# EAGLE design list_1 (EAGLE 6.3)
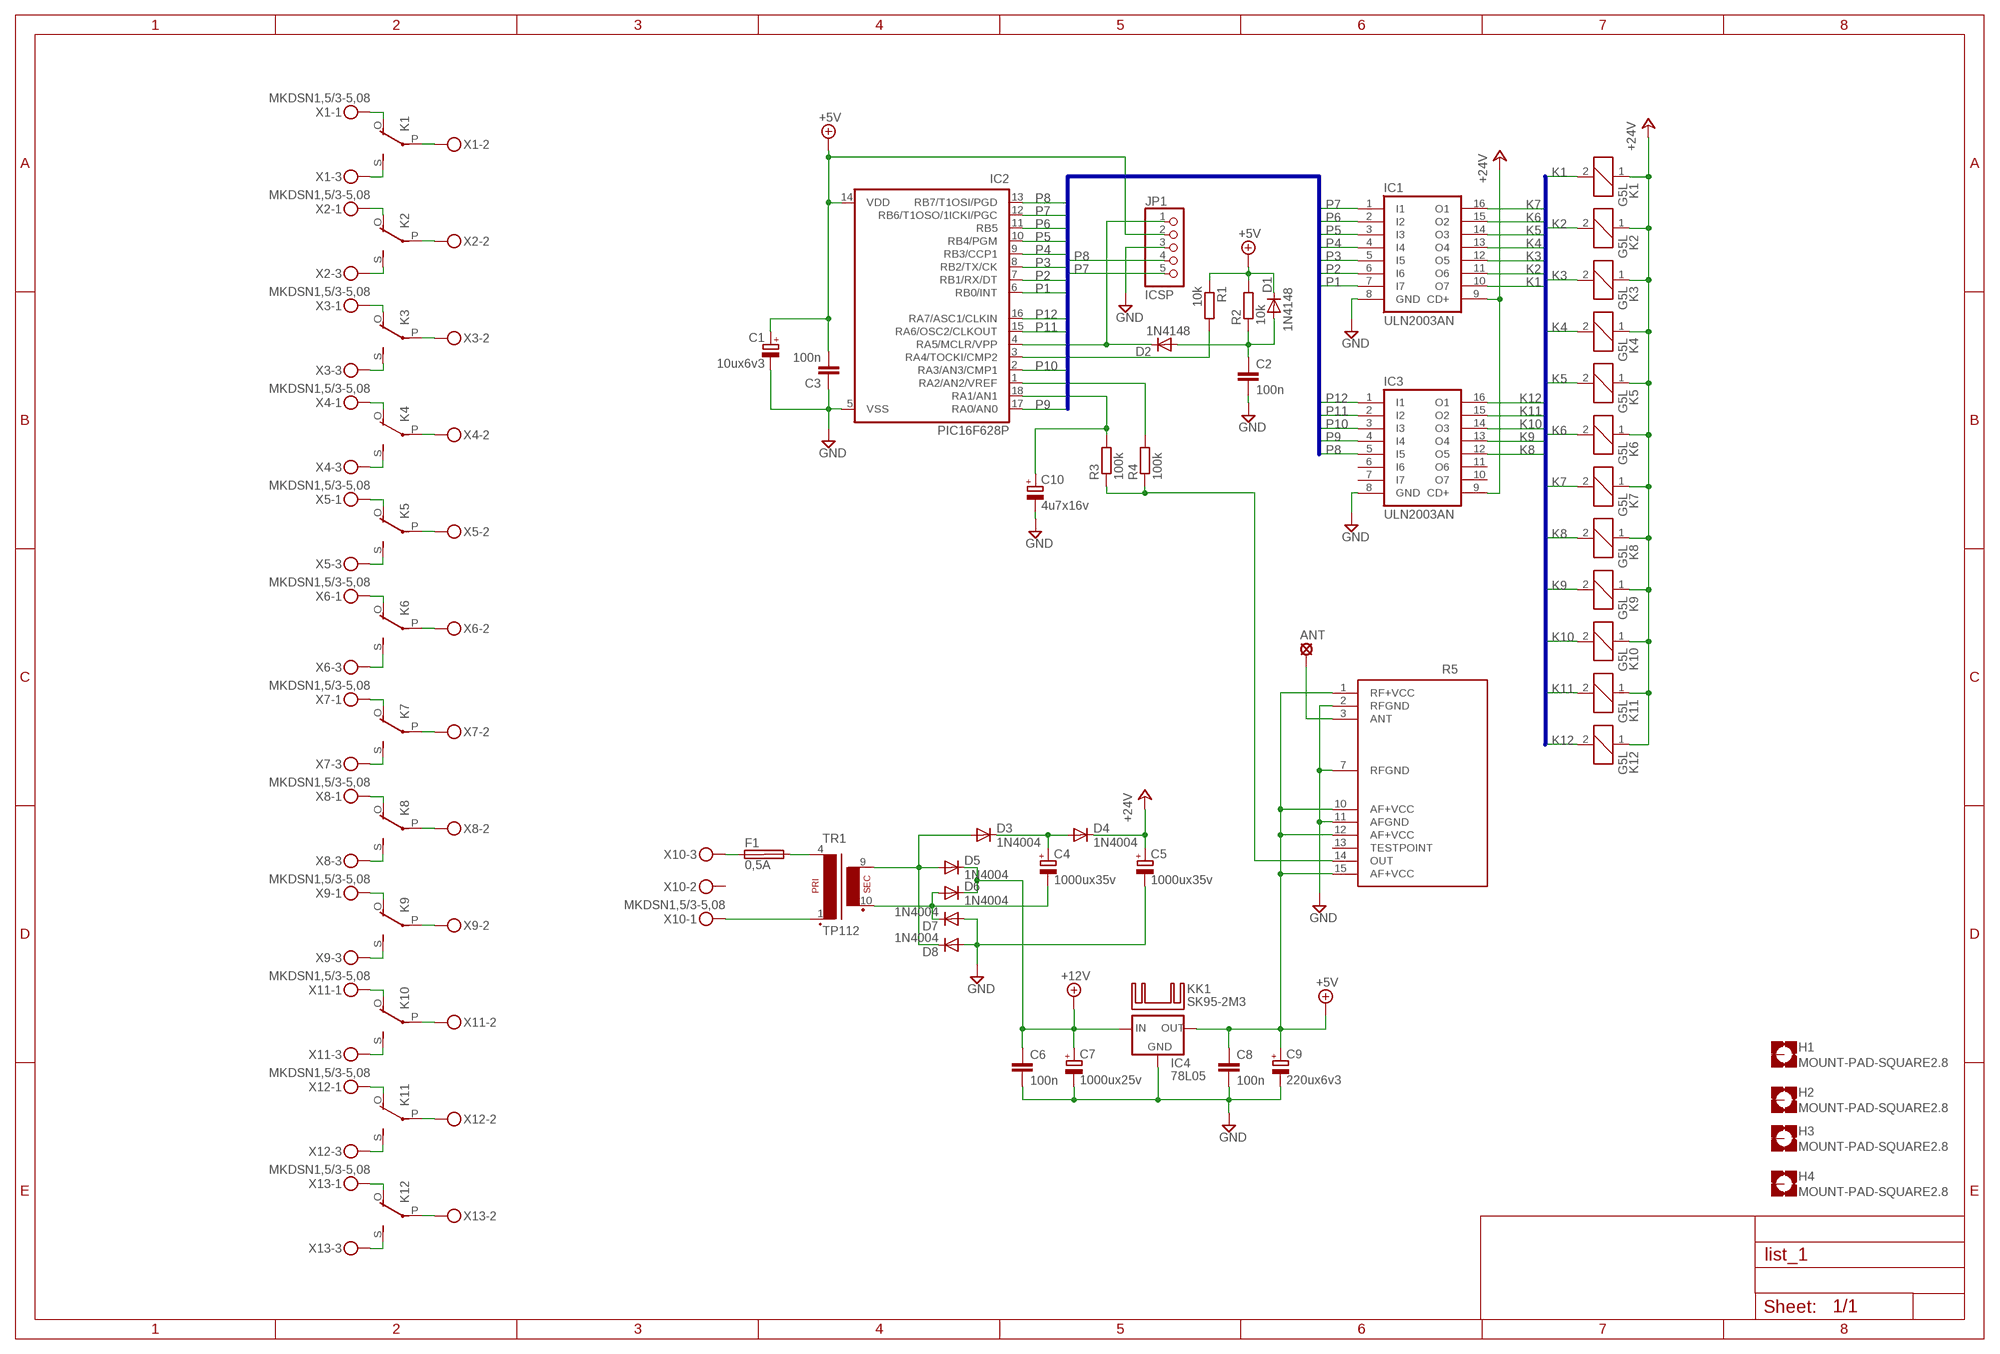
[diagram p0: schematic, sheet 1]

## Parts
ANT  SE14  [SE14]
C1  10ux6v3  CPOL-EUE2.5-5  [E2,5-5]
C2  100n  C-EU050-025X075  [C050-025X075]
C3  100n  C-EU050-025X075  [C050-025X075]
C4  1000ux35v  CPOL-EUE3.5-8  [E3,5-8]
C5  1000ux35v  CPOL-EUE3.5-10  [E3,5-10]
C6  100n  C-EU050-025X075  [C050-025X075]
C7  1000ux25v  CPOL-EUE3.5-8  [E3,5-8]
C8  100n  C-EU050-025X075  [C050-025X075]
C9  220ux6v3  CPOL-EUE2.5-5  [E2,5-5]
C10  4u7x16v  CPOL-EUE2.5-5  [E2,5-5]
D1  1N4148  1N4148DO35-10  [DO35-10]
D2  1N4148  1N4148DO35-10  [DO35-10]
D3  1N4004  [DO41-10]
D4  1N4004  [DO41-10]
D5  1N4004  [DO41-10]
D6  1N4004  [DO41-10]
D7  1N4004  [DO41-10]
D8  1N4004  [DO41-10]
F1  0,5A  SHK20L  [SHK20L]
H1  MOUNT-PAD-SQUARE2.8  [2,8-PAD-SQUARE]
H2  MOUNT-PAD-SQUARE2.8  [2,8-PAD-SQUARE]
H3  MOUNT-PAD-SQUARE2.8  [2,8-PAD-SQUARE]
H4  MOUNT-PAD-SQUARE2.8  [2,8-PAD-SQUARE]
IC1  ULN2003AN  [DIL16]
IC2  PIC16F628P  [DIL18]
IC3  ULN2003AN  [DIL16]
IC4  78L05  78XXS  [78XXS]
JP1  ICSP  PINHD-1X5  [1X05]
K1  G5L  [G5LE]
K2  G5L  [G5LE]
K3  G5L  [G5LE]
K4  G5L  [G5LE]
K5  G5L  [G5LE]
K6  G5L  [G5LE]
K7  G5L  [G5LE]
K8  G5L  [G5LE]
K9  G5L  [G5LE]
K10  G5L  [G5LE]
K11  G5L  [G5LE]
K12  G5L  [G5LE]
KK1  SK95-2M3  [SK95-2M3]
R1  10k  R-EU_0207/10  [0207/10]
R2  10k  R-EU_0207/10  [0207/10]
R3  100k  R-EU_0207/10  [0207/10]
R4  100k  R-EU_0207/10  [0207/10]
R5  RR10  [RR10V]
TR1  TP112  [TR112]
X1  MKDSN1,5/3-5,08  [MKDSN1,5/3-5,08]
X2  MKDSN1,5/3-5,08  [MKDSN1,5/3-5,08]
X3  MKDSN1,5/3-5,08  [MKDSN1,5/3-5,08]
X4  MKDSN1,5/3-5,08  [MKDSN1,5/3-5,08]
X5  MKDSN1,5/3-5,08  [MKDSN1,5/3-5,08]
X6  MKDSN1,5/3-5,08  [MKDSN1,5/3-5,08]
X7  MKDSN1,5/3-5,08  [MKDSN1,5/3-5,08]
X8  MKDSN1,5/3-5,08  [MKDSN1,5/3-5,08]
X9  MKDSN1,5/3-5,08  [MKDSN1,5/3-5,08]
X10  MKDSN1,5/3-5,08  [MKDSN1,5/3-5,08]
X11  MKDSN1,5/3-5,08  [MKDSN1,5/3-5,08]
X12  MKDSN1,5/3-5,08  [MKDSN1,5/3-5,08]
X13  MKDSN1,5/3-5,08  [MKDSN1,5/3-5,08]

## Nets
+5V: C1.+ C3.2 C8.1 C9.+ D1.C IC2.14(VDD) IC4.OUT JP1.2 R1.1 R2.2 R5.1(RF+VCC) R5.10(AF+VCC) R5.12(AF+VCC) R5.15(AF+VCC)
+12V: C6.1 C7.+ D5.C D6.C IC4.IN
+24V: C5.+ D4.C IC1.9(CD+) IC3.9(CD+) K1.1 K2.1 K3.1 K4.1 K5.1 K6.1 K7.1 K8.1 K9.1 K10.1 K11.1 K12.1
GND: C1.- C2.2 C3.1 C5.- C6.2 C7.- C8.2 C9.- C10.- D7.A D8.A IC1.8(GND) IC2.5(VSS) IC3.8(GND) IC4.GND JP1.3 R5.2(RFGND) R5.7(RFGND) R5.11(AFGND)
K1: IC1.10(O7) K1.2
K2: IC1.11(O6) K2.2
K3: IC1.12(O5) K3.2
K4: IC1.13(O4) K4.2
K5: IC1.14(O3) K5.2
K6: IC1.15(O2) K6.2
K7: IC1.16(O1) K7.2
K8: IC3.12(O5) K8.2
K9: IC3.13(O4) K9.2
K10: IC3.14(O3) K10.2
K11: IC3.15(O2) K11.2
K12: IC3.16(O1) K12.2
N$1: K2.S(2:S) X2.3
N$2: K1.P(2:P) X1.2
N$3: K1.S(2:S) X1.3
N$4: K1.O(2:O) X1.1
N$5: K2.O(2:O) X2.1
N$6: K2.P(2:P) X2.2
N$7: K3.P(2:P) X3.2
N$8: K3.S(2:S) X3.3
N$9: K3.O(2:O) X3.1
N$10: K4.O(2:O) X4.1
N$11: K4.P(2:P) X4.2
N$12: K4.S(2:S) X4.3
N$13: K5.P(2:P) X5.2
N$14: K5.O(2:O) X5.1
N$15: K5.S(2:S) X5.3
N$16: K6.P(2:P) X6.2
N$17: K6.O(2:O) X6.1
N$18: K6.S(2:S) X6.3
N$19: K7.P(2:P) X7.2
N$20: K7.O(2:O) X7.1
N$21: K7.S(2:S) X7.3
N$22: K8.P(2:P) X8.2
N$23: K9.P(2:P) X9.2
N$24: K10.P(2:P) X11.2
N$25: K11.P(2:P) X12.2
N$26: K12.P(2:P) X13.2
N$27: K8.O(2:O) X8.1
N$28: K8.S(2:S) X8.3
N$29: K9.O(2:O) X9.1
N$30: K9.S(2:S) X9.3
N$31: K10.O(2:O) X11.1
N$32: K10.S(2:S) X11.3
N$33: K11.O(2:O) X12.1
N$34: K11.S(2:S) X12.3
N$35: K12.O(2:O) X13.1
N$36: K12.S(2:S) X13.3
N$37: C10.+ IC2.18(RA1/AN1) R3.2
N$38: IC2.1(RA2/AN2/VREF) R4.2
N$39: R3.1 R4.1 R5.14(OUT)
N$40: D2.C IC2.4(RA5/MCLR/VPP) JP1.1
N$41: IC2.3(RA4/TOCKI/CMP2) R1.2
N$42: C2.1 D1.A D2.A R2.1
N$43: ANT.MP R5.3(ANT)
N$45: F1.2A TR1.4(P1)
N$47: TR1.1(P2) X10.1
N$48: F1.1A X10.3
N$49: C4.- D6.A D7.C TR1.10(S3)
N$50: D3.A D5.A D8.C TR1.9(S4)
N$53: C4.+ D3.C D4.A
P1: IC1.7(I7) IC2.6(RB0/INT)
P2: IC1.6(I6) IC2.7(RB1/RX/DT)
P3: IC1.5(I5) IC2.8(RB2/TX/CK)
P4: IC1.4(I4) IC2.9(RB3/CCP1)
P5: IC1.3(I3) IC2.10(RB4/PGM)
P6: IC1.2(I2) IC2.11(RB5)
P7: IC1.1(I1) IC2.12(RB6/T1OSO/1ICKI/PGC) JP1.5
P8: IC2.13(RB7/T1OSI/PGD) IC3.5(I5) JP1.4
P9: IC2.17(RA0/AN0) IC3.4(I4)
P10: IC2.2(RA3/AN3/CMP1) IC3.3(I3)
P11: IC2.15(RA6/OSC2/CLKOUT) IC3.2(I2)
P12: IC2.16(RA7/ASC1/CLKIN) IC3.1(I1)
Unconnected: F1.1B F1.2B H1.B2,8(MOUNT) H2.B2,8(MOUNT) H3.B2,8(MOUNT) H4.B2,8(MOUNT) IC3.6(I6) IC3.7(I7) IC3.10(O7) IC3.11(O6) R5.13(TESTPOINT) X10.2

## Buses
K[1..12]
P[1..12]

## Library data of the parts
ANT = solpad:SE14: SOLDER PAD E1553, drill 1,4mm, distributor Buerklin, 07F820
C1 C4 C5 C7 C9 C10 = rcl:CPOL-EU: POLARIZED CAPACITOR, European symbol
C2 C3 C6 C8 = rcl:C-EU: CAPACITOR, European symbol
D1 D2 = diode:1N4148: DIODE high speed (Philips)
D3-D8 = diode:1N4004: DIODE general purpose rectifier, 1 A
F1 = fuse:SHK20L: FUSE HOLDER 5 x 20 mm, SH contact, SHH1 Schukat, E1073 Buerklin
H1-H4 = holes:MOUNT-PAD-SQUARE: MOUNTING PAD, square
IC1 IC3 = uln-udn:ULN2003A: DRIVER ARRAY
IC2 = microchip:PIC16*F62: FLASH-Based 8-Bit CMOS Microcontroller Source: http://ww1.microchip.com/downloads/en/DeviceDoc/40300C.pdf
IC4 = v-reg:78XXS: VOLTAGE REGULATOR
JP1 = pinhead:PINHD-1X5: PIN HEADER
K1-K12 = relay:G5L: RELAY 1 x switch, 10 A/120 V AC, 8 A/30 V ADC, Omron
KK1 = heatsink:SK95-2M3: HEATSINK manufacturer Fischer/distributor Buerklin
R1-R4 = rcl:R-EU_: RESISTOR, European symbol
R5 = rf_moduls:RR10: Moduls telecontrolli Narrow Bandwidth Super Regenerati Receiver - RR10-XXX
TR1 = trafo:TP112
X1-X13 = con-phoenix-508:MKDSN1,5/3-5,08: MKDSN 1,5/ 3-5,08 Printklemme Nennstrom: 13,5 A Nennspannung: 250 V Rastermaß: 5,08 mm Polzahl: 3 Anschlussart: Schraubanschluss Montage: Löten Anschlussrichtung Leiter/Platine: 0 ° Artikelnummer: 1729131 Source: http://eshop.phoenixcontact.com .. 1729131.pdf

## Board
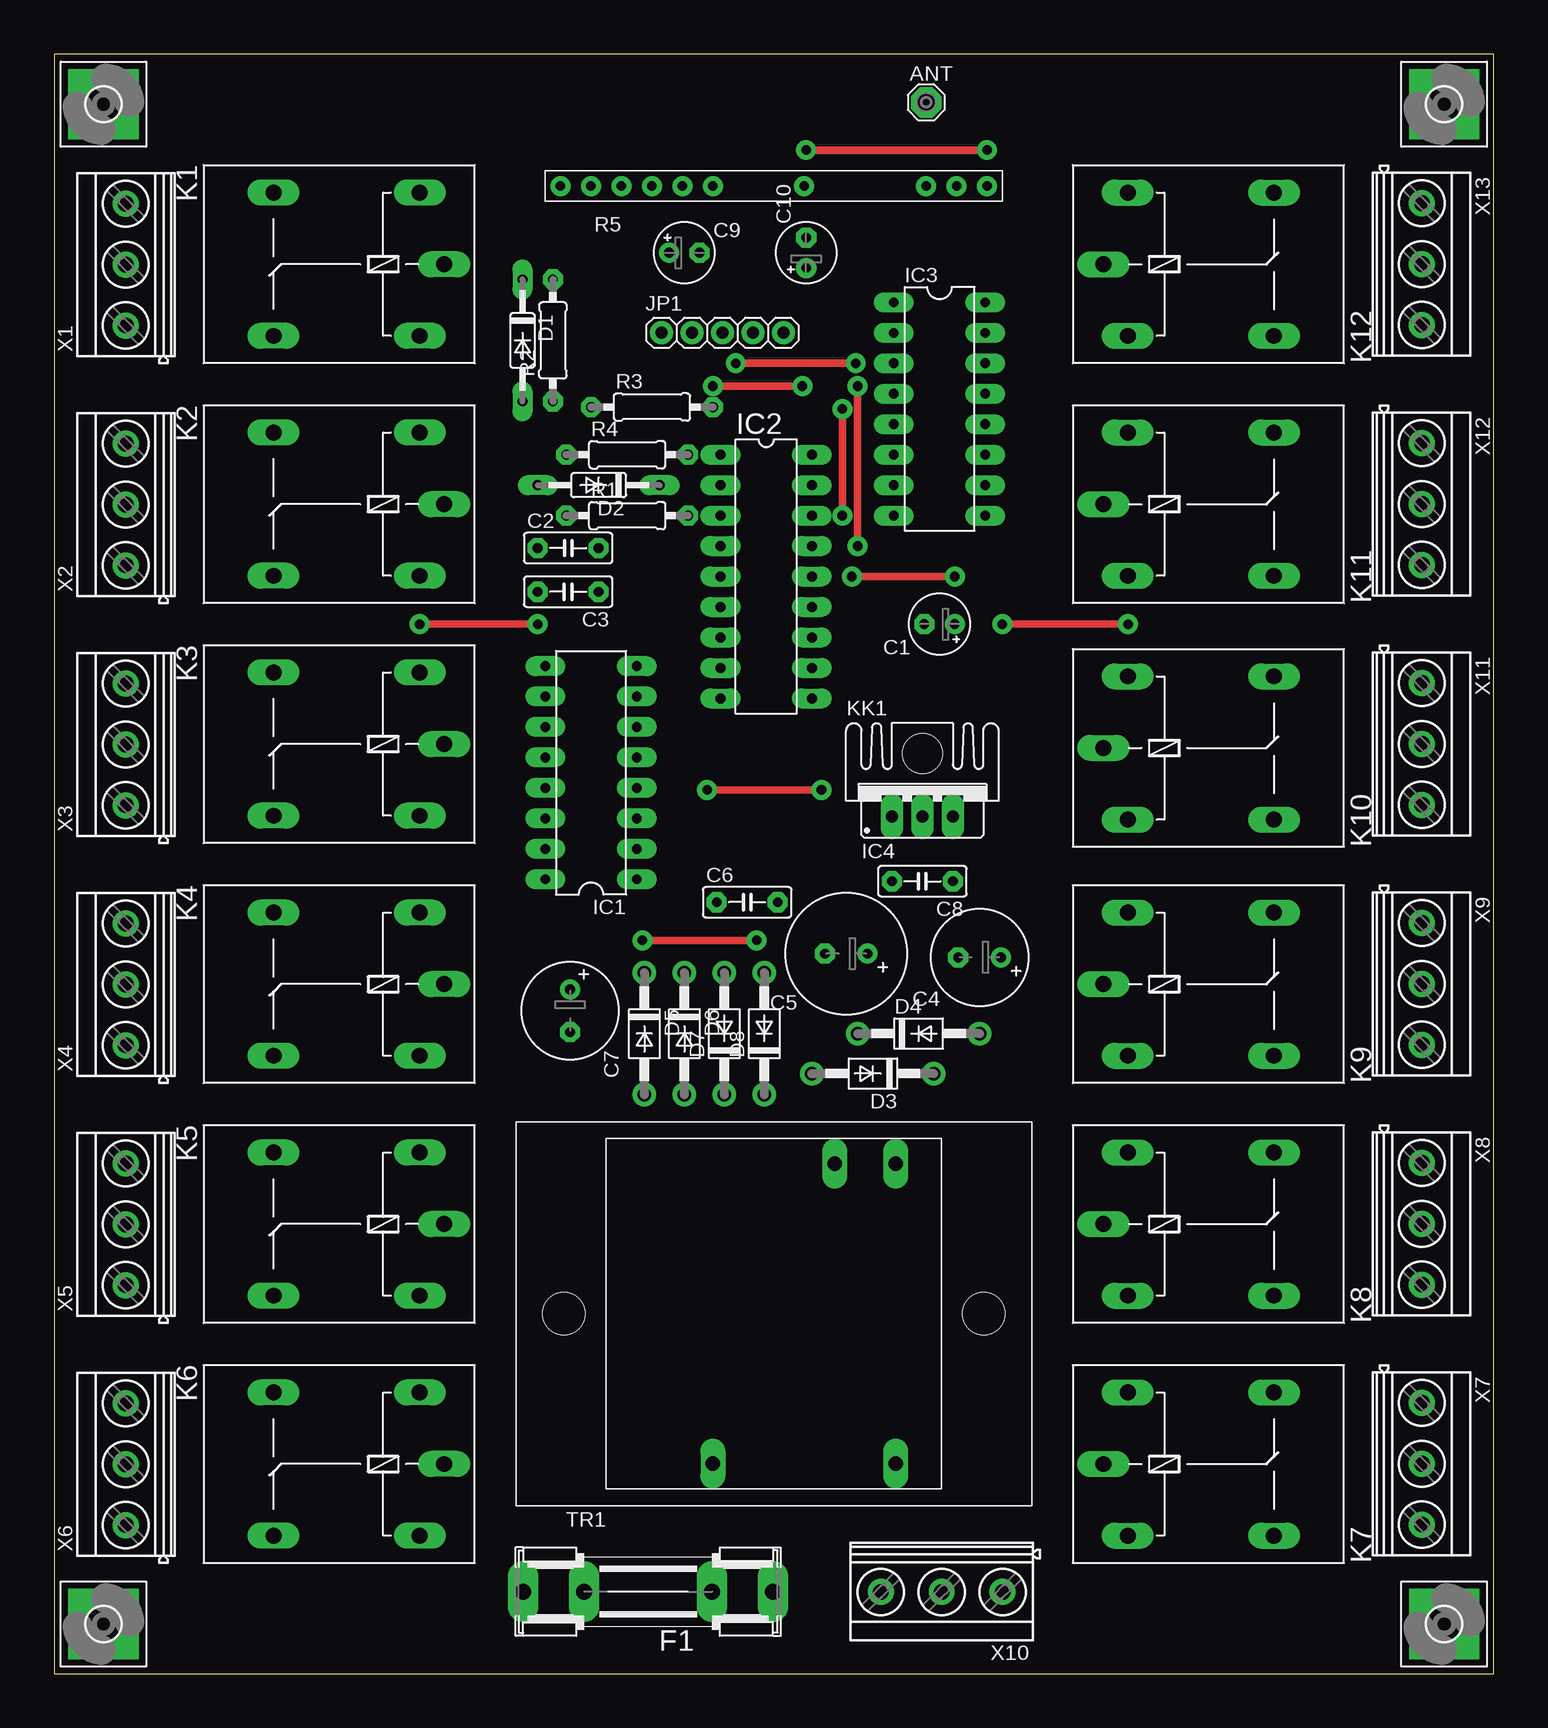
[diagram p1: board, top side]
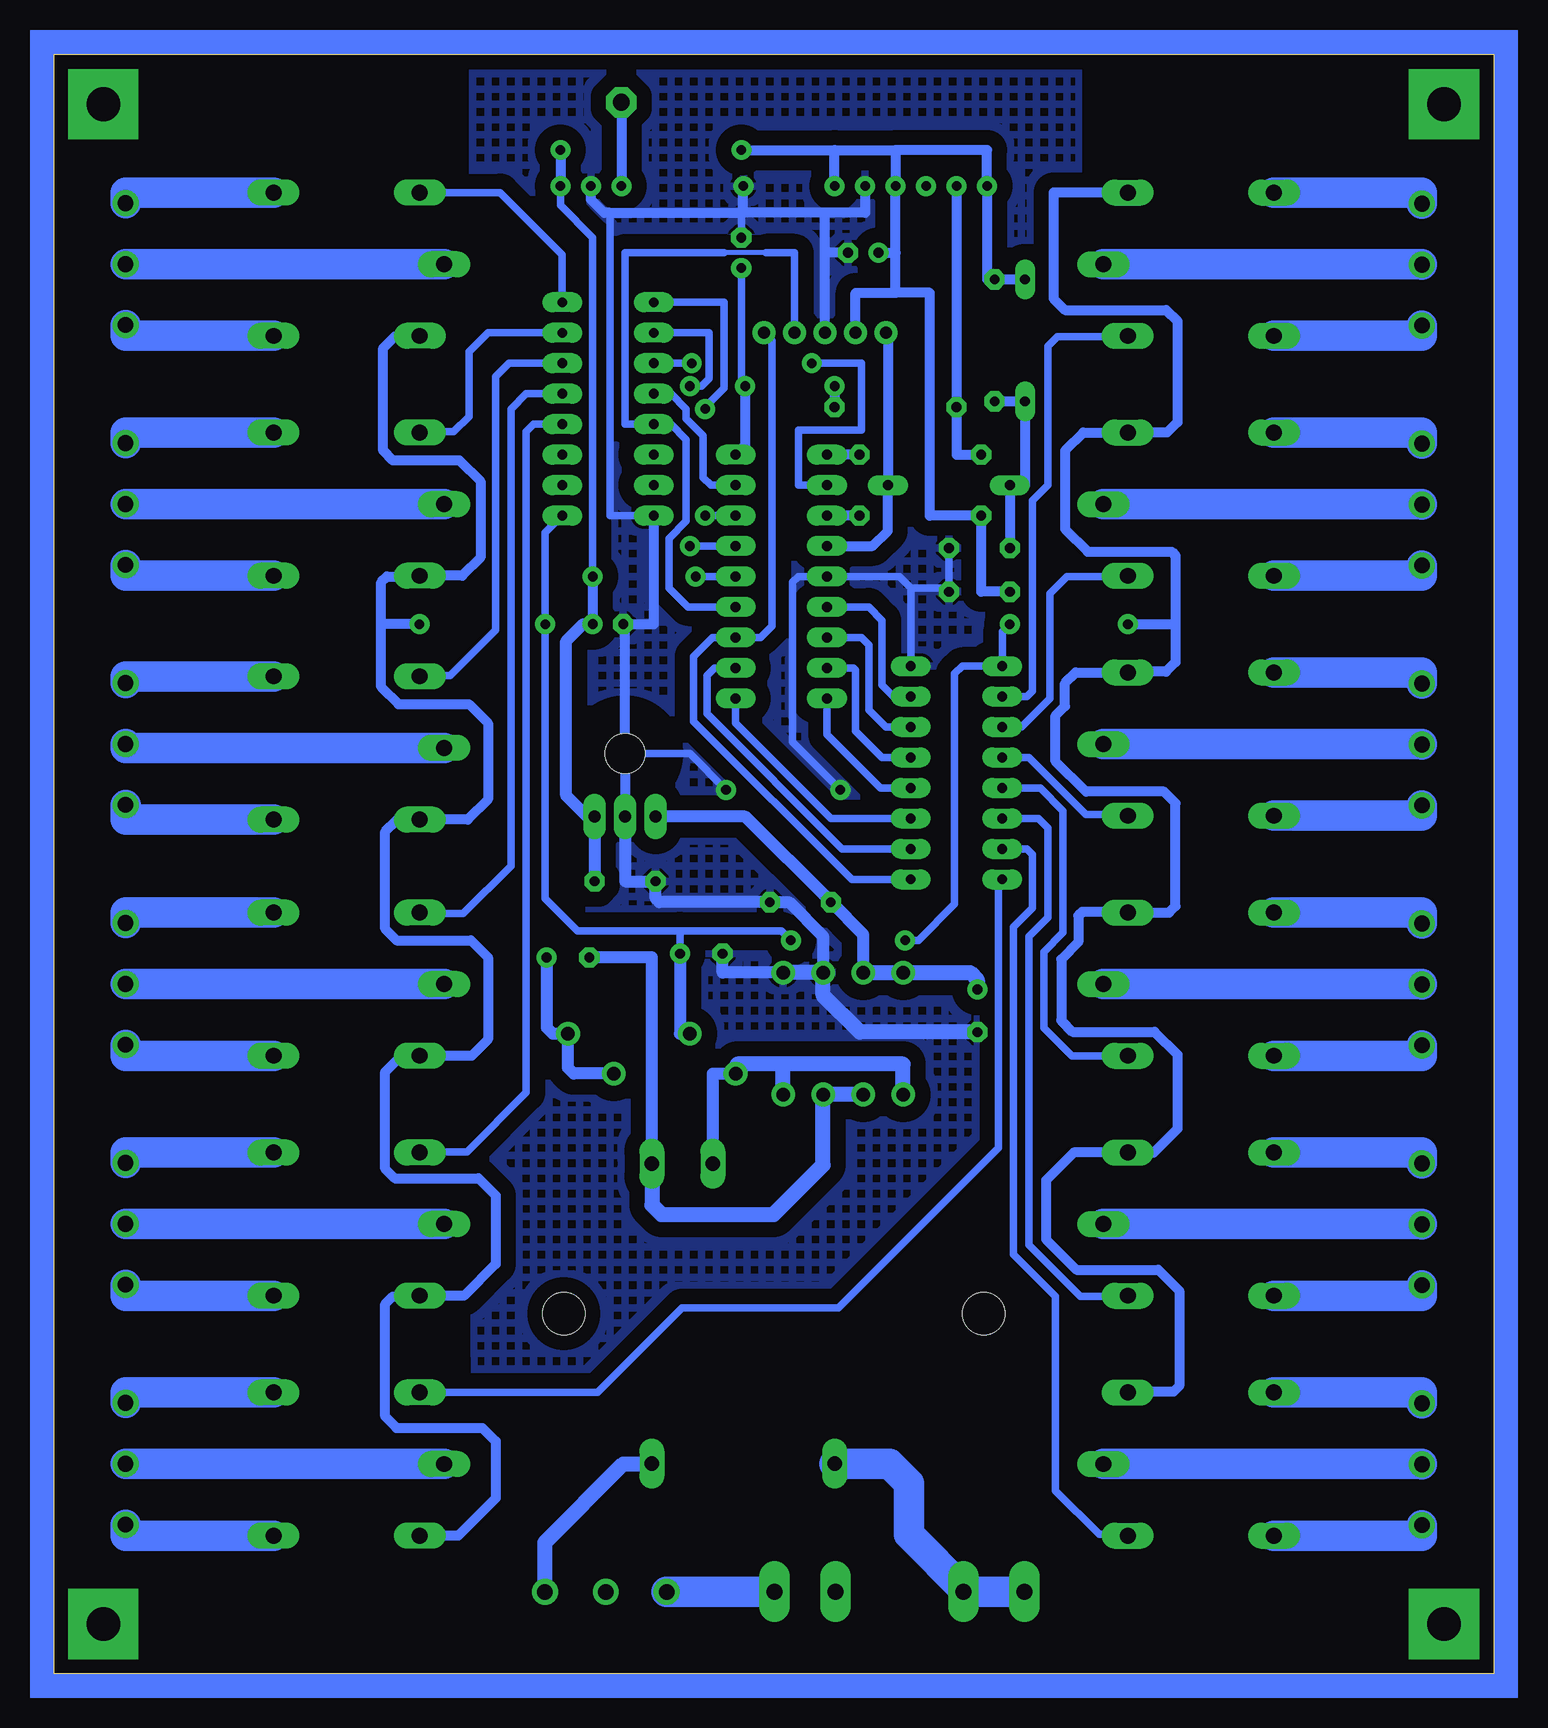
[diagram p2: board, bottom side, seen from below]

Size 120 x 135 mm. Coordinates in mm from the lower left corner, seen from the top.
Outline: 0,0 120,0 120,135 0,135 0,0
Copper layers (1*16): Top 0.035mm / dielectric 1.5mm / Bottom 0.035mm
Design rules "default *": minimum track width 10mil, minimum drill 20mil, track to track 8mil, track to pad 8mil, pad to pad 8mil, via to via 8mil, smd to smd 8mil, copper to edge 40mil, drill to drill 8mil, minimum pad ring 17mil, minimum via ring 17mil, stop-mask expansion 4mil, vias tented up to drill 0mil, thermal gap 10mil

### Footprints (pad centres in the part's own frame; a part is rotated, then mirrored left to right if it is on the bottom)
SE14 = drill 1.397 pad 2.54 octagon: MP 0,0
E2,5-5 = drill 0.813 pad 1.6: + -1.27,0 | drill 0.813 pad 1.6 octagon: - 1.27,0
C050-025X075 = drill 0.813 octagon: 1 -2.54,0; 2 2.54,0
E3,5-8 = drill 0.813 pad 1.6: + -1.778,0 | drill 0.813 pad 1.6 octagon: - 1.778,0
E3,5-10 = drill 0.813 pad 1.6: + -1.778,0 | drill 0.813 pad 1.6 octagon: - 1.778,0
DO35-10 = drill 0.813 long: A 5.08,0; C -5.08,0
DO41-10 = drill 1.118: A 5.08,0; C -5.08,0
SHK20L = drill 1.321 pad 2.54 long: 1A -10.414,0; 1B -5.334,0; 2A 10.414,0; 2B 5.334,0
2,8-PAD-SQUARE = drill 2.8 pad 5.842 square: B2,8 0,0
DIL16 = drill 0.813 long: 1 -8.89,-3.81; 2 -6.35,-3.81; 3 -3.81,-3.81; 4 -1.27,-3.81; 5 1.27,-3.81; 6 3.81,-3.81; 7 6.35,-3.81; 8 8.89,-3.81; 9 8.89,3.81; 10 6.35,3.81; 11 3.81,3.81; 12 1.27,3.81; 13 -1.27,3.81; 14 -3.81,3.81; 15 -6.35,3.81; 16 -8.89,3.81
DIL18 = drill 0.813 long: 1 -10.16,-3.81; 2 -7.62,-3.81; 3 -5.08,-3.81; 4 -2.54,-3.81; 5 0,-3.81; 6 2.54,-3.81; 7 5.08,-3.81; 8 7.62,-3.81; 9 10.16,-3.81; 10 10.16,3.81; 11 7.62,3.81; 12 5.08,3.81; 13 2.54,3.81; 14 0,3.81; 15 -2.54,3.81; 16 -5.08,3.81; 17 -7.62,3.81; 18 -10.16,3.81
78XXS = drill 1.016 long: GND 0,-2.54; IN -2.54,-2.54; OUT 2.54,-2.54
1X05 = drill 1.016 pad 1.93: 1 -5.08,0; 2 -2.54,0; 3 0,0; 4 2.54,0; 5 5.08,0
G5LE = drill 1.321 long: 1 -7.493,-5.969; 2 -7.493,5.969; O 4.699,5.969; P -9.525,0; S 4.699,-5.969
SK95-2M3 = hole 3.302: 0,2.54
0207/10 = drill 0.813 octagon: 1 -5.08,0; 2 5.08,0
RR10V = drill 0.8: 1 -17.78,0; 2 -15.24,0; 3 -12.7,0; 7 -2.54,0; 10 5.08,0; 11 7.62,0; 12 10.16,0; 13 12.7,0; 14 15.24,0; 15 17.78,0
TR112 = drill 1.2 long: 1 -10.16,12.5; 4 5.08,12.5; 9 -5.08,-12.5; 10 -10.16,-12.5 | hole 3.5: -17.5,0; 17.5,0
MKDSN1,5/3-5,08 = drill 1.3 pad 2: 1 -7.641,0.025; 2 -2.561,0.025; 3 2.519,0.025

### Placement (x,y rotation side)
ANT  72.71,130.97 0 top
C1  73.82,87.47 180 top
C2  42.86,93.82 0 top
C3  42.86,90.17 180 top
C4  77.15,59.69 180 top
C5  66.04,60.01 180 top
C6  57.78,64.29 0 top
C7  43.02,55.24 270 top
C8  72.39,66.04 180 top
C9  52.55,118.43 0 top
C10  62.71,118.43 90 top
D1  39.05,111.12 270 top
D2  45.4,99.06 180 top
D3  68.26,50.01 180 top
D4  72.07,53.34 0 top
D5  49.21,53.34 270 top
D6  52.55,53.34 270 top
D7  55.88,53.34 90 top
D8  59.21,53.34 90 top
F1  49.53,6.83 180 top
H1  4.13,4.13 0 top
H2  4.13,130.81 0 top
H3  115.89,130.81 0 top
H4  115.89,4.13 0 top
IC1  44.77,75.09 90 top
IC2  59.37,91.44 270 top
IC3  73.82,105.41 270 top
IC4  72.39,73.98 0 top
JP1  55.72,111.76 0 top
K1  23,117.47 180 top
K2  23,97.47 180 top
K3  23,77.47 180 top
K4  23,57.47 180 top
K5  23,37.47 180 top
K6  23,17.46 180 top
K7  97,17.46 0 top
K8  97,37.47 0 top
K9  97,57.47 0 top
K10  97,77.15 0 top
K11  97,97.47 0 top
K12  97,117.47 0 top
KK1  72.39,74.14 0 top
R1  47.78,96.52 0 top
R2  41.59,111.12 90 top
R3  49.85,105.57 0 top
R4  47.78,101.6 0 top
R5  60,123.98 180 top
TR1  60,30 180 top
X1  6,120 90 top
X2  6,100 90 top
X3  6,80 90 top
X4  6,60 90 top
X5  6,40 90 top
X6  6,20 90 top
X7  114,14.92 270 top
X8  114,34.92 270 top
X9  114,54.92 270 top
X10  71.44,6.83 180 top
X11  114,74.92 270 top
X12  114,94.92 270 top
X13  114,114.92 270 top

### Tracks (layer width: path | path; a pad name or v marks a point on that pad's centre or on a via)
+5V  (via drill 0.8)
  Top 0.61: v62.71,127 v77.79,127 | v66.52,91.44 v75.09,91.44
  Bottom 0.61: IC2.14 v66.52,91.44 | v75.09,91.44 75.09,119.7 77.79,122.4 R5.1
  Bottom 0.813: 49.85,127 42.22,127 R5.15 42.22,116.2 R2.2 D1.C | 49.85,127 R5.12 | v62.71,127 54.93,127 | 54.93,127 49.85,127 | JP1.2 53.18,115.09 49.85,115.09 | 49.85,115.09 49.85,118.43 | 49.85,118.43 R5.12 | R5.12 | 49.85,115.09 46.99,115.09 46.99,96.52 R1.1 42.7,90.17 C3.2 | C9.+ 49.85,118.43 | v77.79,127 R5.1 | R5.10 54.92,126.99 54.93,127 | v75.09,91.44 C1.+
  Bottom 1.016: IC4.OUT 74.93,70.8 | 74.93,70.8 C8.1 | 74.93,70.8 77.31,73.18 77.31,86.04 75.88,87.47 C1.+
+12V
  Bottom 1.016: D6.C 52.55,61.59 C6.1 62.39,71.44 IC4.IN
  Bottom 1.27: D6.C D5.C 43.62,58.42 43.02,57.82 C7.+
+24V  (via drill 0.8)
  Top 0.61: v49.05,61.12 v58.58,61.12 | v40.32,87.47 v30.48,87.47 | v89.53,87.47 v79.06,87.47
  Bottom 0.61: IC3.9 79.06,95.09 v79.06,87.47 79.06,64.61 76.36,61.91 67.82,61.91 | 67.82,61.91 C5.+ | v49.05,61.12 47.94,61.12 44.93,64.14 44.93,83.34 44.29,83.98 IC1.9 40.96,86.84 v40.32,87.47 | 67.82,61.91 59.37,61.91 v58.58,61.12
  Bottom 0.813: K11.1 85.98,91.5 84.45,93.03 84.45,99.38 86.2,101.12 91.76,101.12 92.55,101.92 92.55,110.49 91.6,111.44 89.57,111.44 K12.1 | K11.1 89.53,91.47 | K7.1 86.3,11.49 83.19,14.61 83.19,19.37 84.3,20.48 91.44,20.48 92.39,21.43 92.39,30.8 91.76,31.43 89.57,31.43 K8.1 85.82,31.5 83.19,34.13 83.19,39.85 84.61,41.27 91.6,41.27 92.39,42.07 92.39,50.16 91.12,51.44 89.57,51.44 K9.1 85.19,51.5 83.82,52.86 83.82,59.69 85.25,61.12 91.44,61.12 92.39,62.07 92.39,70.17 91.44,71.12 89.57,71.12 K10.1 85.5,71.18 83.82,72.87 83.82,79.22 85.41,80.8 91.28,80.8 92.71,82.23 92.71,87.47 | K1.1 36.67,123.44 36.67,114.62 35.72,113.67 27.3,113.67 26.35,112.71 26.35,104.3 27.21,103.44 K2.1 34.2,103.44 35.72,101.92 35.72,95.41 33.81,93.5 26.83,93.5 26.51,93.19 26.51,87.31 | 26.51,87.31 26.51,84.3 27.3,83.5 30.43,83.5 K3.1 34.83,83.44 35.72,82.55 35.72,80.64 36.51,79.85 36.51,76.04 33.97,73.5 27.46,73.5 26.51,72.55 26.51,63.98 27.05,63.44 K4.1 30.56,63.5 34.29,63.5 34.61,63.18 34.61,60.96 36.04,59.53 36.04,54.45 35.08,53.5 28.26,53.5 26.35,51.59 26.35,45.4 28.32,43.43 K5.1 34.99,43.43 37.31,41.12 37.31,36.2 34.77,33.66 27.94,33.66 26.19,31.91 26.19,23.97 26.67,23.5 30.43,23.5 K6.1 | v30.48,87.47 26.67,87.47 26.51,87.31 | 92.71,87.47 92.71,90.96 92.23,91.44 89.57,91.44 K11.1 | v89.53,87.47 92.71,87.47
  Bottom 1.016: C5.+ 67.82,53.34 D4.C
GND  (via drill 0.6 pad 3.2, 0.8)
  Top 0.61: v54.45,73.66 v63.98,73.66
  Bottom 0.61: 48.58,90.49 49.53,91.44 IC2.5 57.94,91.44 58.42,90.96 58.42,77.63 v54.45,73.66 | 48.58,90.49 45.4,90.49 C3.1 C2.2 | IC3.8 73.66,96.52 73.66,121.76 | IC1.8 48.58,90.49 | v63.98,73.66 66.99,76.68 v72.39,76.68 | C10.- 62.71,121.76
  Bottom 0.813: R5.11 52.38,121.76 55.72,121.76 | 55.72,121.76 62.55,121.76 | 62.55,121.76 R5.7 | 62.55,121.76 62.71,121.76 73.66,121.76 74.14,121.76 75.25,122.87 R5.2 | JP1.3 55.72,118.43 | 55.72,118.43 55.72,121.76 | C9.- 55.72,118.43 | IC3.8 70.01,87.47 C1.- 72.39,87.47 v72.39,76.68 IC4.GND
  Bottom 1.016: IC4.GND 72.39,66.04 C8.2 69.85,64.61 69.53,64.29 C6.2 58.74,64.29 55.88,61.44 D7.A | D8.A 64.26,58.42 C5.-
  Bottom 1.27: D8.A D7.A 55.88,56.52 52.83,53.47 C7.-
  pour Bottom (isolate 1.27, hatched): 34.61,11.27 34.61,134.3 85.09,134.46 84.93,10.95 82.07,10.95 82.23,21.43 81.28,22.38 74.3,22.38 69.53,27.15 40.48,27.15 38.26,24.92 38.26,11.27
K1
  Bottom 0.61: IC1.10 38.89,81.44 38.42,81.92 38.42,97.79 37.15,99.06 37.15,110.65 36.35,111.44 31.56,111.44 K1.2
K2
  Bottom 0.61: IC1.11 39.37,78.9 36.99,81.28 36.99,90.01 35.56,91.44 30.56,91.44 K2.2
K3
  Bottom 0.61: IC1.12 38.73,76.36 33.97,71.6 30.59,71.6 K3.2
K4
  Bottom 0.61: IC1.13 37.78,73.82 35.88,71.91 35.88,61.75 37.47,60.17 37.47,53.82 35.15,51.5 K4.2
K5
  Bottom 0.61: IC1.14 37.94,71.28 37.15,70.48 37.15,63.02 38.73,61.44 38.73,35.72 34.45,31.43 30.56,31.43 K5.2
K6
  Bottom 0.61: IC1.15 38.89,68.74 38.42,68.26 38.42,63.82 40.01,62.23 40.01,34.92 36.51,31.43 36.51,15.24 32.86,11.59 30.59,11.59 K6.2
K7
  Bottom 0.61: IC1.16 41.27,65.88 41.27,43.81 54.61,30.48 67.63,30.48 74.68,23.43 K7.2
K8
  Bottom 0.61: IC3.12 80.01,104.14 80.64,103.5 80.64,48.42 85.57,43.5 88.44,43.5 K8.2
K9
  Bottom 0.61: K9.2 88.41,63.34 85.88,63.34 81.92,67.31 81.92,105.41 80.64,106.68 IC3.13
K10
  Bottom 0.61: K10.2 88.44,83.19 87,83.19 83.19,87 83.19,108.11 82.07,109.22 IC3.14
K11
  Bottom 0.61: IC3.15 83.82,111.76 85.41,110.17 85.41,104.78 86.68,103.5 88.44,103.5 K11.2
K12
  Bottom 0.61: K12.2 82.8,123.44 77.63,118.27 IC3.16
N$1
  Bottom 2.54: K2.S 5.97,103.44 X2.3
N$2
  Bottom 2.54: K1.P 5.97,117.47 X1.2
N$3
  Bottom 2.54: K1.S 5.97,123.44 X1.3
N$4
  Bottom 2.54: K1.O 5.97,111.51 X1.1
N$5
  Bottom 2.54: K2.O 5.97,91.5 X2.1
N$6
  Bottom 2.54: K2.P 5.97,97.47 X2.2
N$7
  Bottom 2.54: K3.P 5.97,77.47 X3.2
N$8
  Bottom 2.54: K3.S 5.97,83.44 X3.3
N$9
  Bottom 2.54: K3.O 5.97,71.5 X3.1
N$10
  Bottom 2.54: K4.O 5.97,51.5 X4.1
N$11
  Bottom 2.54: K4.P 5.97,57.47 X4.2
N$12
  Bottom 2.54: K4.S 5.97,63.44 X4.3
N$13
  Bottom 2.54: K5.P 5.97,37.47 X5.2
N$14
  Bottom 2.54: K5.O 5.97,31.5 X5.1
N$15
  Bottom 2.54: K5.S 5.97,43.43 X5.3
N$16
  Bottom 2.54: K6.P 5.97,17.46 X6.2
N$17
  Bottom 2.54: K6.O 5.97,11.49 X6.1
N$18
  Bottom 2.54: K6.S 5.97,23.43 X6.3
N$19
  Bottom 2.54: K7.P 114.03,17.46 X7.2
N$20
  Bottom 2.54: K7.O 114.03,23.43 X7.1
N$21
  Bottom 2.54: K7.S 114.03,11.49 X7.3
N$22
  Bottom 2.54: K8.P 114.03,37.47 X8.2
N$23
  Bottom 2.54: K9.P 114.03,57.47 X9.2
N$24
  Bottom 2.54: K10.P 114.03,77.15 X11.2
N$25
  Bottom 2.54: K11.P X12.2
N$26
  Bottom 2.54: K12.P X13.2
N$27
  Bottom 2.54: K8.O 114.03,43.43 X8.1
N$28
  Bottom 2.54: K8.S 114.03,31.5 X8.3
N$29
  Bottom 2.54: K9.O 114.03,63.44 X9.1
N$30
  Bottom 2.54: K9.S 114.03,51.5 X9.3
N$31
  Bottom 2.54: K10.O 114.03,83.12 X11.1
N$32
  Bottom 2.54: K10.S 114.03,71.18 X11.3
N$33
  Bottom 2.54: K11.O 114.03,103.44 X12.1
N$34
  Bottom 2.54: K11.S 114.03,91.5 X12.3
N$35
  Bottom 2.54: K12.O 114.03,123.44 X13.1
N$36
  Bottom 2.54: K12.S 114.03,111.51 X13.3
N$37  (via drill 0.8)
  Top 0.61: v54.93,107.31 v62.39,107.31
  Bottom 0.61: C10.+ 62.71,107.31 v62.39,107.31
  Bottom 0.813: v62.39,107.31 62.39,102.39 IC2.18 | v54.93,107.31 R3.2
N$38
  Bottom 0.813: R4.2 IC2.1
N$39
  Bottom 0.813: R5.14 44.76,106.04 44.77,106.04 R3.1 44.77,101.6 R4.1
N$40
  Bottom 0.813: JP1.1 50.48,111.28 D2.C 50.48,95.25 51.75,93.98 IC2.4
N$41
  Bottom 0.813: R1.2 IC2.3
N$42
  Bottom 0.813: R2.1 D1.A 39.05,99.06 D2.A C2.1
N$43
  Bottom 0.813: ANT.MP R5.3
N$45
  Bottom 2.54: F1.2A 43.97,6.83 48.74,11.59 48.74,15.88 50.36,17.5 TR1.4
N$47
  Bottom 1.27: X10.1 79.08,10.93 72.55,17.46 70.2,17.46 TR1.1
N$48
  Bottom 2.54: F1.1A 68.92,6.83 X10.3
N$49
  Bottom 1.016: TR1.10 70.16,59.68 70.17,59.69 C4.-
  Bottom 1.27: D6.A D7.C 55.88,42.39 60.01,38.26 69.37,38.26 70.16,39.05 TR1.10
N$50
  Bottom 1.016: TR1.9 65.08,50.01 D3.A
  Bottom 1.27: D5.A 49.21,50.8 59.21,50.8 | 59.21,50.8 63.02,50.8 D3.A | D8.C 59.21,50.8
N$53
  Bottom 1.016: 77.18,53.37 D4.A | C4.+ 78.93,53.85 78.42,53.34 D4.A | D3.C 76.68,50.01 77.15,50.48 D4.A
P1
  Bottom 0.61: IC2.6 52.07,88.9 50.96,87.79 50.96,82.39 50.01,81.44 IC1.7
P2
  Bottom 0.61: IC2.7 52.7,86.36 52.07,85.72 52.07,80.33 50.64,78.9 IC1.6
P3
  Bottom 0.61: IC2.8 53.34,83.82 53.18,83.66 53.18,78.58 50.96,76.36 IC1.5
P4
  Bottom 0.61: IC2.9 55.56,78.26 51.12,73.82 IC1.4
P5
  Bottom 0.61: IC2.10 63.18,79.22 55.24,71.28 IC1.3
P6
  Bottom 0.61: IC1.2 54.29,68.74 65.56,80.01 65.56,83.19 64.93,83.82 IC2.11
P7
  Bottom 0.61: IC1.1 53.5,66.2 66.67,79.38 66.67,84.77 65.09,86.36 IC2.12 61.12,86.36 60.17,87.31 60.17,111.12 JP1.5
P8
  Bottom 0.406: 60.64,118.43 64.14,118.43
  Bottom 0.61: JP1.4 58.26,118.43 60.64,118.43 | IC2.13 67.15,88.9 68.74,90.49 68.74,94.61 67.31,96.04 67.31,102.87 68.58,104.14 IC3.5 72.39,104.14 72.39,118.43 64.14,118.43
P9
  Bottom 0.61: IC2.17 65.25,99.06 65.88,99.69 65.88,103.19 67.31,104.62 67.31,105.41 68.58,106.68 IC3.4
P10  (via drill 0.8)
  Top 0.61: v56.83,109.22 v66.83,109.22
  Bottom 0.61: IC2.2 57.94,99.06 57.94,103.66 52.7,103.66 52.7,109.22 v56.83,109.22 | v66.83,109.22 IC3.3
P11  (via drill 0.8)
  Top 0.61: v66.99,107.31 v66.99,93.98
  Bottom 0.61: IC3.2 65.41,111.76 65.41,107.95 66.04,107.31 v66.99,107.31 | IC2.15 v66.99,93.98
P12  (via drill 0.8)
  Top 0.61: v65.72,105.41 v65.72,96.52
  Bottom 0.61: IC3.1 64.14,114.3 64.14,107.16 65.72,105.57 v65.72,105.41 | IC2.16 v65.72,96.52
(copper drawn outside any net)
  shapes: Bottom area x4